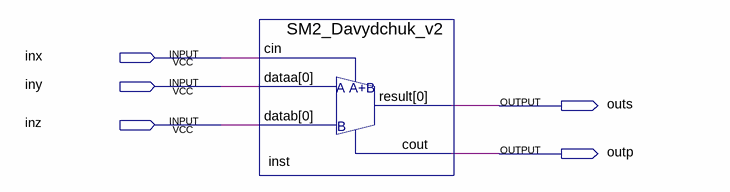
[diagram p0: schematic sheet]
// Quartus schematic CLProject_ArtemDavydchuk_v2.bdf as structural Verilog: 1 symbols, 5 pins
module CLProject_ArtemDavydchuk_v2 (
  input  inx,
  input  iny,
  input  inz,
  output outs,
  output outp
);

  SM2_Davydchuk_v2 inst (.cin(inx), .dataa(iny), .datab(inz), .result(outs), .cout(outp));
endmodule
